# Altium schematic sheet 工业水泵_LCM32F037H6S8_024VDC_SCH_V1.0.SchDoc
size A4
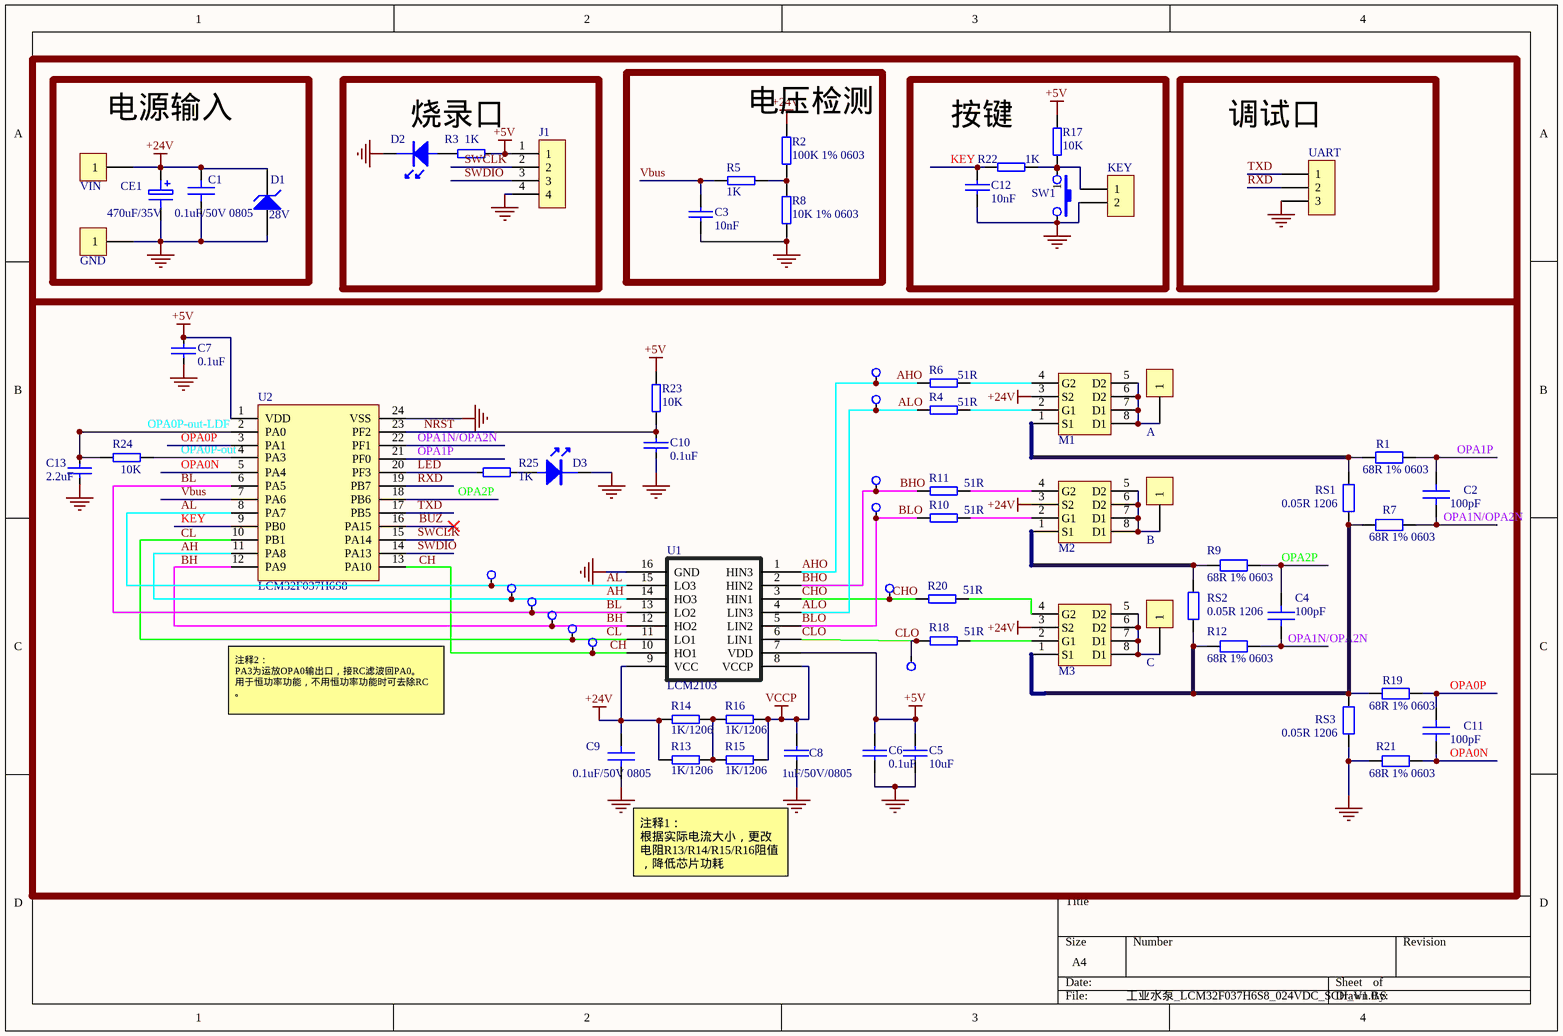
[diagram p0: 工业水泵_LCM32F037H6S8_024VDC_SCH_V1.0.SchDoc]

## Parts
A  CON1  [CON-F1.5]  (value not drawn)
B  CON1  [CON-F1.5]  (value not drawn)
C  CON1  [CON-F1.5]  (value not drawn)
C1  0.1uF/50V 0805  [C0805]
C2  100pF  [C0603]
C3  10nF  [C0603]
C4  100pF  [C0603]
C5  10uF  [C0805]
C6  0.1uF  [C0603]
C7  0.1uF  [C0603]
C8  1uF/50V/0805  [C0805]
C9  0.1uF/50V 0805  [C0805X]
C10  0.1uF  [C0603]
C11  100pF  [C0603]
C12  10nF  [C0603]
C13  2.2uF  [C0603]
CE1  470uF/35V  [C-DR10-5]
D1  28V  [SMB]
D2  (no value)  [0603-LED/H]
D3  (no value)  [0603-LED/H]
GND  CON1  [CON-F1.5]  (value not drawn)
J1  CON4  [SIP4]  (value not drawn)
KEY  CON2  [SIP2]  (value not drawn)
M1  BPM0405CG  [SOP-8S]  (value not drawn)
M2  BPM0405CG  [SOP-8S]  (value not drawn)
M3  BPM0405CG  [SOP-8S]  (value not drawn)
R1  68R 1% 0603  [R0603]
R2  100K 1% 0603  [R0603]
R3  1K  [R0603]
R4  51R  [R0603]
R5  1K  [R0603]
R6  51R  [R0603]
R7  68R 1% 0603  [R0603]
R8  10K 1% 0603  [R0603]
R9  68R 1% 0603  [R0603]
R10  51R  [R0603]
R11  51R  [R0603]
R12  68R 1% 0603  [R0603]
R13  1K/1206  [1206/X]
R14  1K/1206  [1206/X]
R15  1K/1206  [1206/X]
R16  1K/1206  [1206/X]
R17  10K  [R0603]
R18  51R  [R0603]
R19  68R 1% 0603  [R0603]
R20  51R  [R0603]
R21  68R 1% 0603  [R0603]
R22  1K  [R0603]
R23  10K  [R0603]
R24  10K  [R0603]
R25  1K  [R0603]
RS1  0.05R 1206  [1206/X]
RS2  0.05R 1206  [1206/X]
RS3  0.05R 1206  [1206/X]
SW1  SW-PB  (value not drawn)
TP1  TestPoint  [TP_1.0-A]  (value not drawn)
TP2  TestPoint  [TP_1.0-A]  (value not drawn)
TP3  TestPoint  [TP_1.0-A]  (value not drawn)
TP4  TestPoint  [TP_1.0-A]  (value not drawn)
TP5  TestPoint  [TP_1.0-A]  (value not drawn)
TP6  TestPoint  [TP_1.0-A]  (value not drawn)
TP7  TestPoint  [TP_1.0-A]  (value not drawn)
TP8  TestPoint  [TP_1.0-A]  (value not drawn)
TP9  TestPoint  [TP_1.0-A]  (value not drawn)
TP10  TestPoint  [TP_1.0-A]  (value not drawn)
TP11  TestPoint  [TP_1.0-A]  (value not drawn)
TP12  TestPoint  [TP_1.0-A]  (value not drawn)
U1  LCM2103  [SOP16]
U2  LCM32F037H6S8  [SSOP24-H]
UART  CON3  [SIP3]  (value not drawn)
VIN  CON1  [CON-F1.5]  (value not drawn)

## Blocks framed on the sheet
电源输入: C1 CE1 D1 GND VIN
烧录口: D2 J1 R3
电压检测: C3 R2 R5 R8
按键: C12 KEY R17 R22 SW1
调试口: UART

## Nets
+5V: C5.2 C6.2 C7.1 J1.1 R3.2 R17.1 R23.1 U1.7(VDD) U2.1(VDD)
+24V: C1.1 C9.1 CE1.1 D1.2(K) M1.3(S2) M2.3(S2) M3.3(S2) R2.1 R13.2 R14.2 U1.9(VCC) VIN.1
GND: C1.2 C3.2 C5.1 C6.1 C7.2 C8.1 C9.2 C10.2 C12.2 C13.2 CE1.2 D1.1(A) D2.1 D3.1 GND.1 J1.4 KEY.2 R8.2 R21.2 RS3.2 SW1.2 U1.16(GND) U2.24(VSS) UART.3
VCCP: C8.2 R15.1 R16.1 U1.8(VCCP)
AH: TP8.1 U1.14(HO3) U2.11(PA8)
AHO: R6.1 TP1.1 U1.1(HIN3)
AL: TP7.1 U1.15(LO3) U2.8(PA7)
ALO: R4.1 TP2.1 U1.4(LIN3)
BH: TP10.1 U1.12(HO2) U2.12(PA9)
BHO: R11.1 TP3.1 U1.2(HIN2)
BL: TP9.1 U1.13(LO2) U2.6(PA5)
BLO: R10.1 TP4.1 U1.5(LIN2)
BUZ: U2.16(PA15)
CH: TP12.1 U1.10(HO1) U2.13(PA10)
CHO: R20.1 TP5.1 U1.3(HIN1)
CL: TP11.1 U1.11(LO1) U2.10(PB1)
CLO: R18.1 TP6.1 U1.6(LIN1)
KEY: C12.1 R22.1 U2.9(PB0)
LED: R25.2 U2.20(PF3)
NRST: C10.1 R23.2 U2.23(PF2)
OPA0N: C11.1 R21.1 U2.5(PA4)
OPA0P: C11.2 R19.1 U2.3(PA1)
OPA0P-out: R24.1 U2.4(PA3)
OPA0P-out-LDF: C13.1 R24.2 U2.2(PA0)
OPA1N/OPA2N: C2.1 C4.1 R7.1 R12.1 U2.22(PF1)
OPA1P: C2.2 R1.1 U2.21(PF0)
OPA2P: C4.2 R9.1 U2.18(PB6)
RXD: U2.19(PB7) UART.2
SWCLK: J1.2 U2.15(PA14)
SWDIO: J1.3 U2.14(PA13)
TXD: U2.17(PB5) UART.1
Vbus: C3.1 R5.2 U2.7(PA6)
NetA_1: A.1 M1.5(D2) M1.6(D2) M1.7(D1) M1.8(D1)
NetB_1: B.1 M2.5(D2) M2.6(D2) M2.7(D1) M2.8(D1)
NetC_1: C.1 M3.5(D2) M3.6(D2) M3.7(D1) M3.8(D1)
NetD2_2: D2.2 R3.1
NetD3_2: D3.2 R25.1
NetKEY_1: KEY.1 R17.2 R22.2 SW1.1
NetM1_1: M1.1(S1) R1.2 RS1.1
NetM1_2: M1.2(G1) R4.2
NetM1_4: M1.4(G2) R6.2
NetM2_1: M2.1(S1) R9.2 RS2.1
NetM2_2: M2.2(G1) R10.2
NetM2_4: M2.4(G2) R11.2
NetM3_1: M3.1(S1) R7.2 R12.2 R19.2 RS1.2 RS2.2 RS3.1
NetM3_2: M3.2(G1) R18.2
NetM3_4: M3.4(G2) R20.2
NetR2_2: R2.2 R5.1 R8.1
NetR13_1: R13.1 R14.1 R15.2 R16.2

## Notes on the sheet
- 注释2：
  PA3为运放OPA0输出口，接RC滤波回PA0。
  用于恒功率功能，不用恒功率功能时可去除RC。
- 注释1：
  根据实际电流大小，更改电阻R13/R14/R15/R16阻值，降低芯片功耗
- Labels drawn without touching a wire or pin: AH, BH, CH, CL

## Library data of the parts
A B C GND VIN = CON1: Connector
C1 C2 C4 C9 C11 = C-0603-104K50-X7R: 贴片电容; MPN1: CC0603KRX7R9BB104; SPEC: 0.1uF,50V,±10%, X7R; TYPE: SMD; VENDOR1: 国巨; VENDOR2: 华新科; NAME: 贴片电容; MPN2: 0603B104K500CT; PRICE: *
C3 C5 C6 C8 C12 = CAP: Capacitor
C7 C10 C13 = CAP
CE1 = CAP_ELECTRO: Electrolytic Capacitor
D1 = D Zener: 稳压管; Published: 8-Jun-2000; LatestRevisionDate: 17-Jul-2002; LatestRevisionNote: Re-released for DXP Platform.; PackageReference: DIODE-0.7; Publisher: Altium Limited; PackageDescription: Diode, Thru-Hole; 2 Leads; 0.7 in Pin Spacing
D2 D3 = LED
KEY = CON2: Connector
R1 R7 R9 R12 R19 R21 RS1-RS3 = R-0603-10K-J: 贴片电阻; code: R-0603-103-J
R2-R6 R8 R10 R11 R13-R18 R20 R22-R25 = RES
U1 = MX8324
U2 = LM32
UART = CON3: Connector